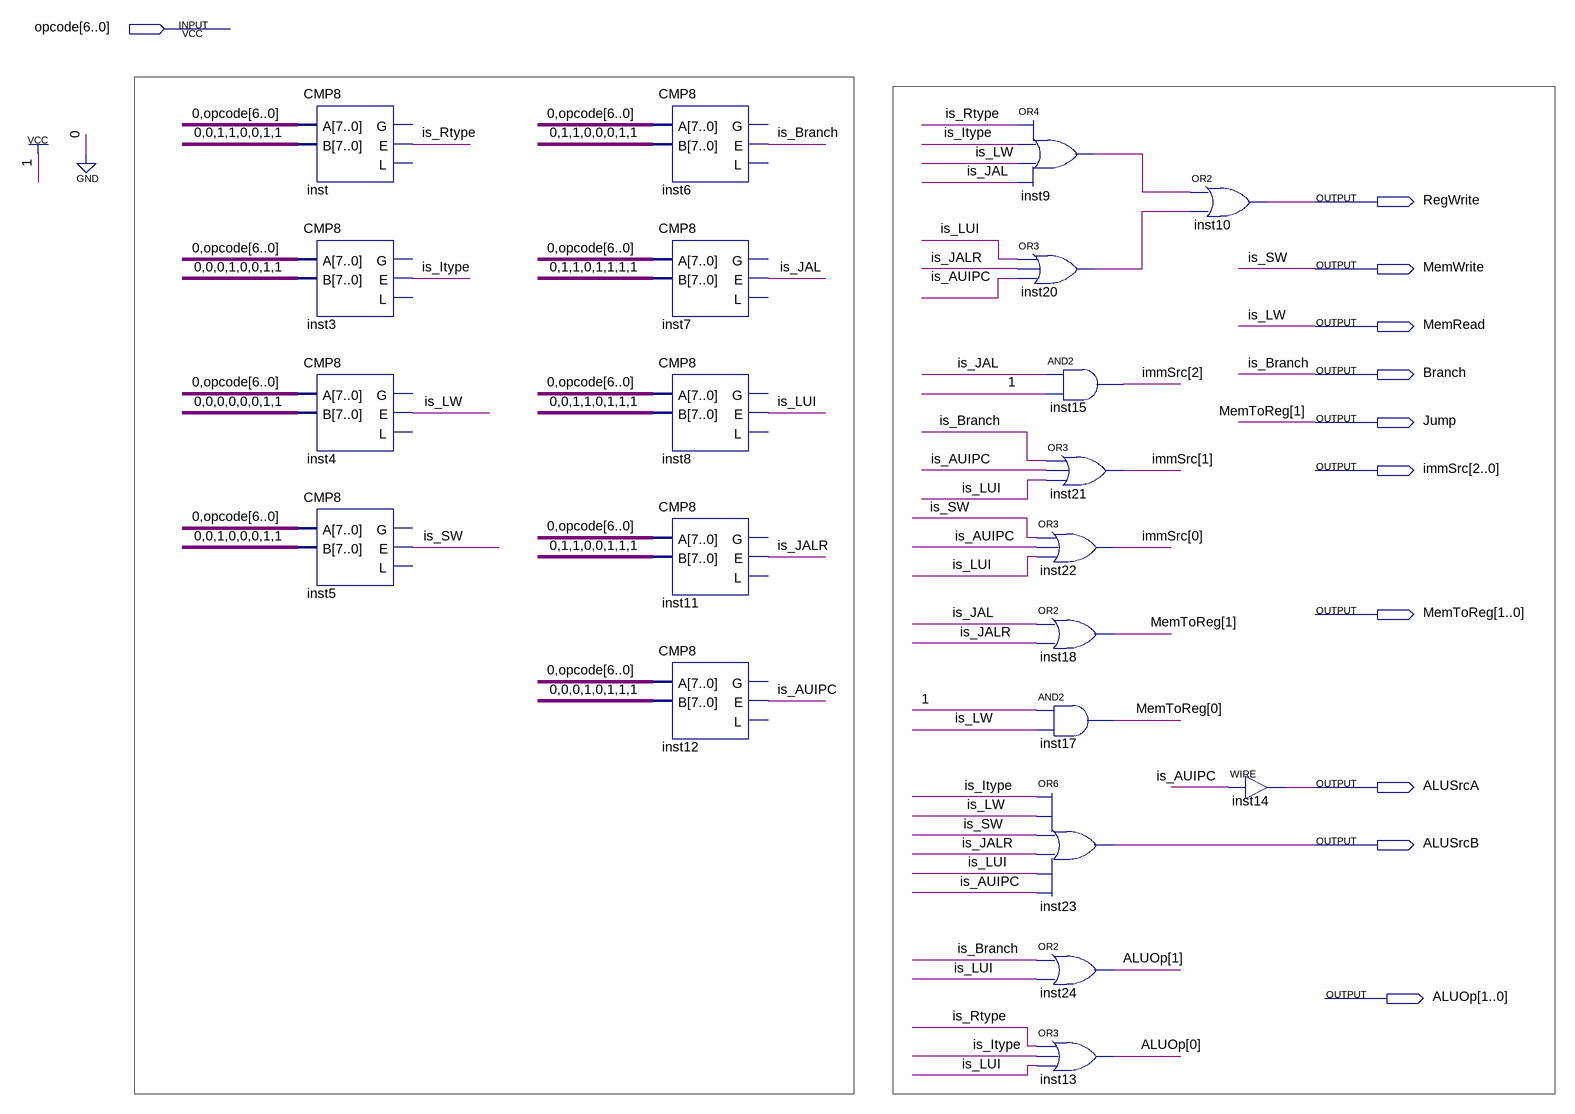
[diagram p0: schematic sheet]
// Quartus schematic ControlWord.bdf as structural Verilog: 21 symbols, 11 pins
module ControlWord (
  input  [6:0] opcode,
  output RegWrite,
  output MemWrite,
  output MemRead,
  output Branch,
  output Jump,
  output [2:0] immSrc,
  output [1:0] MemToReg,
  output ALUSrcA,
  output ALUSrcB,
  output [1:0] ALUOp
);

  wire inst9_out, inst20_out, is_AUIPC, is_Itype, is_JAL, is_JALR, is_LUI, is_Rtype;

  CMP8 inst (.A({1'b0, opcode}), .B(8'b00110011), .E(is_Rtype));  // open: G, L
  CMP8 inst3 (.A({1'b0, opcode}), .B(8'b00010011), .E(is_Itype));  // open: G, L
  CMP8 inst4 (.A({1'b0, opcode}), .B(8'b00000011), .E(MemRead));  // open: G, L
  CMP8 inst5 (.A({1'b0, opcode}), .B(8'b00100011), .E(MemWrite));  // open: G, L
  CMP8 inst6 (.A({1'b0, opcode}), .B(8'b01100011), .E(Branch));  // open: G, L
  CMP8 inst7 (.A({1'b0, opcode}), .B(8'b01101111), .E(is_JAL));  // open: G, L
  CMP8 inst8 (.A({1'b0, opcode}), .B(8'b00110111), .E(is_LUI));  // open: G, L
  CMP8 inst11 (.A({1'b0, opcode}), .B(8'b01100111), .E(is_JALR));  // open: G, L
  CMP8 inst12 (.A({1'b0, opcode}), .B(8'b00010111), .E(is_AUIPC));  // open: G, L
  or inst9 (inst9_out, is_Rtype, is_Itype, MemRead, is_JAL);
  or inst20 (inst20_out, is_LUI, is_JALR, is_AUIPC);
  and inst15 (immSrc[2], is_JAL, 1'b1);
  or inst21 (immSrc[1], Branch, is_AUIPC, is_LUI);
  or inst22 (immSrc[0], MemWrite, is_AUIPC, is_LUI);
  or inst18 (Jump, is_JAL, is_JALR);
  and inst17 (MemToReg[0], 1'b1, MemRead);
  or inst23 (ALUSrcB, is_Itype, MemRead, MemWrite, is_JALR, is_LUI, is_AUIPC);
  or inst24 (ALUOp[1], Branch, is_LUI);
  or inst13 (ALUOp[0], is_Rtype, is_Itype, is_LUI);
  or inst10 (RegWrite, inst9_out, inst20_out);
  assign ALUSrcA = is_AUIPC;  // WIRE inst14

  assign MemToReg[1] = Jump;

  // Other names for the same wires on the sheet: is_Branch = Branch; is_LW = MemRead; is_SW = MemWrite
endmodule
